# EAGLE board mixer (EAGLE 6.5.0), part 1 of 2
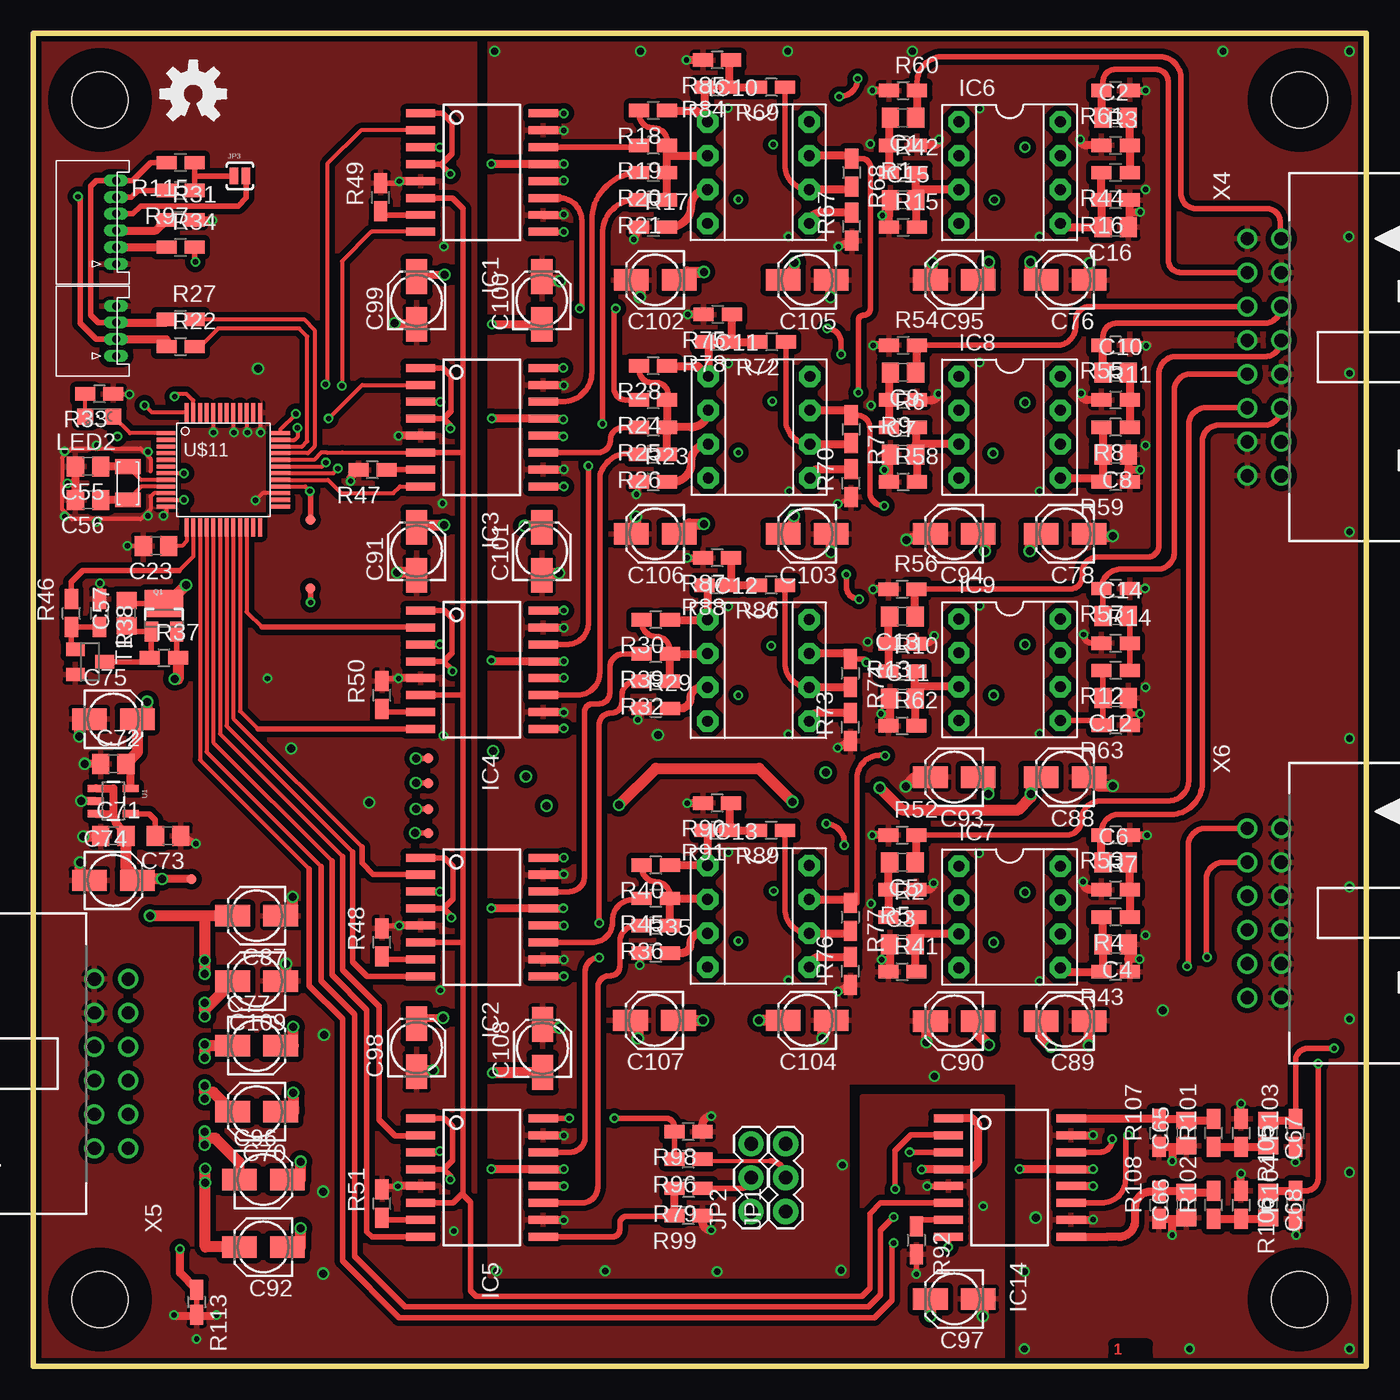
[diagram p2: board, top side]
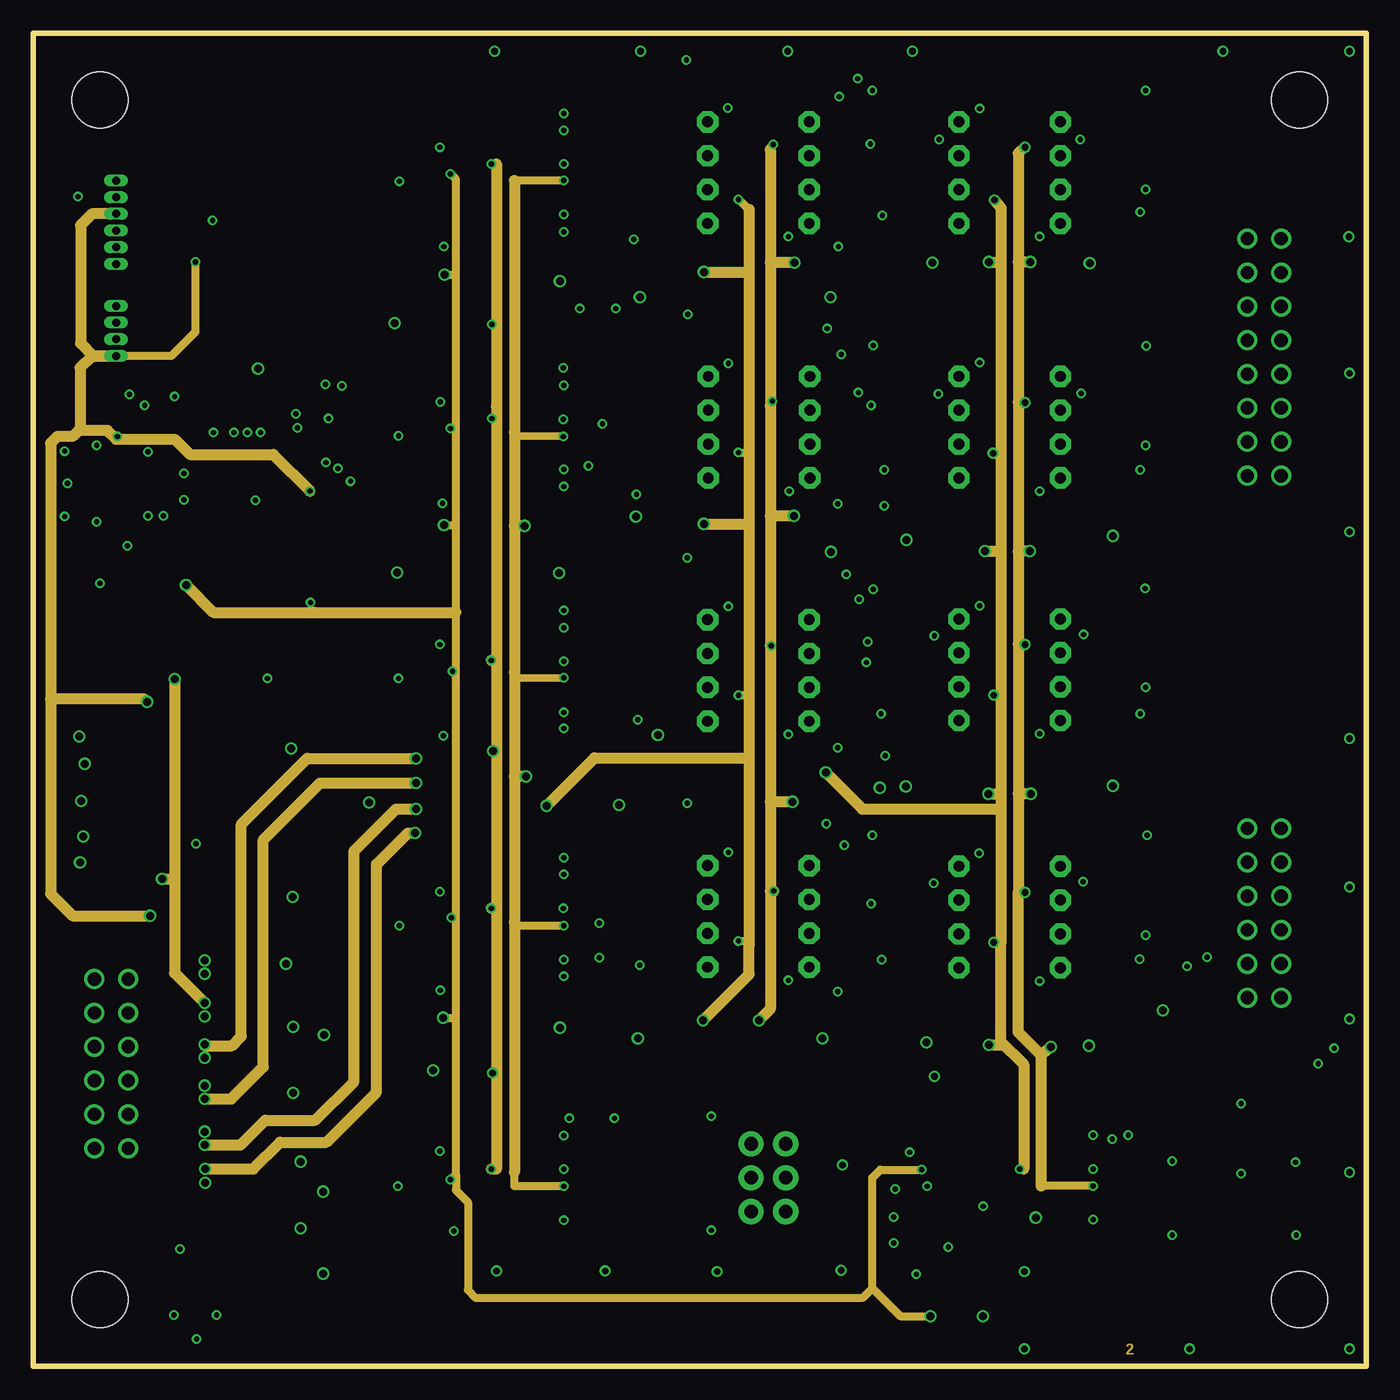
[diagram p3: board, inner layer Route2]
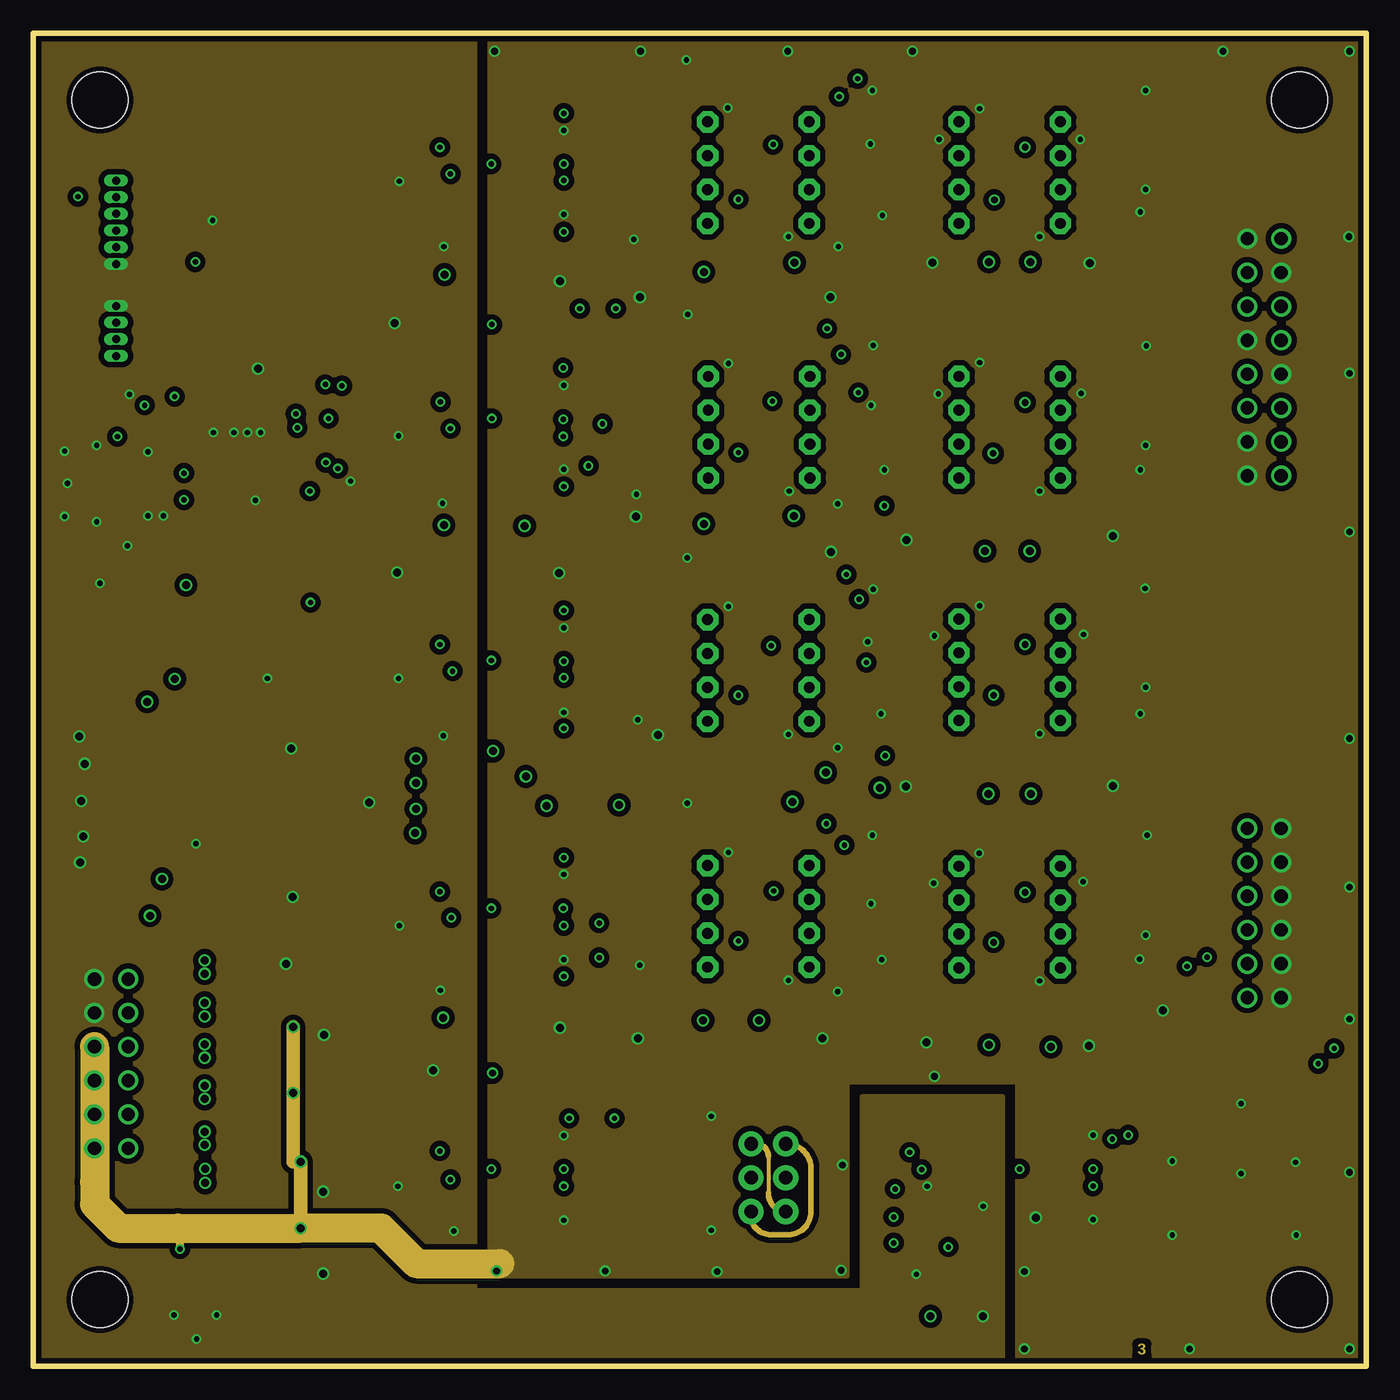
[diagram p4: board, inner layer Route15]
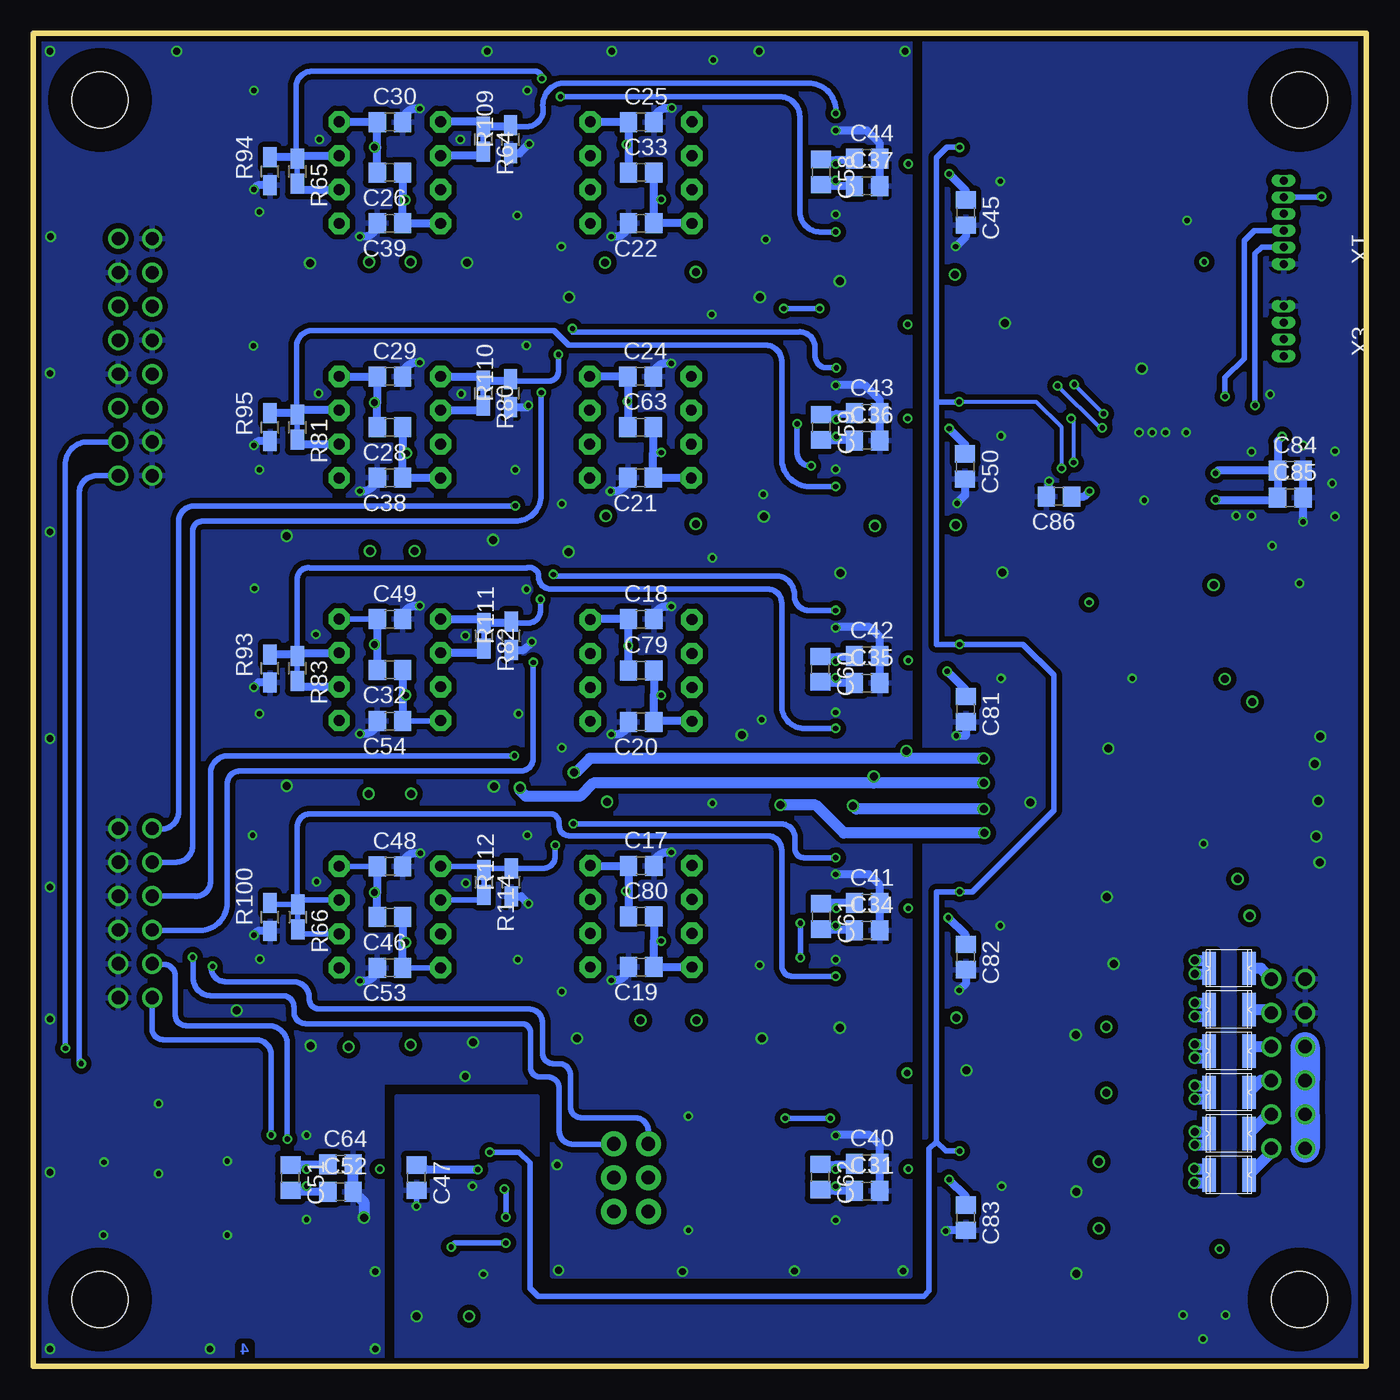
[diagram p5: board, bottom side, seen from below]

Size 100 x 100 mm. Coordinates in mm from the lower left corner, seen from the top.
Outline: 0,0 100,0 100,100 0,100 0,0
Copper layers (1*2*15*16): Top 0.035mm / dielectric 0.2mm / Route2 0.0175mm / dielectric 1.1mm / Route15 0.0175mm / dielectric 0.2mm / Bottom 0.035mm
Design rules "SeeedStudio_DRU_no_angle_20130527": minimum track width 6mil, minimum drill 12mil, track to track 6mil, track to pad 6mil, pad to pad 6mil, via to via 6mil, smd to smd 0mil, copper to edge 10mil, drill to drill 10mil, minimum pad ring 6mil, minimum via ring 6mil, stop-mask expansion 2mil, vias tented up to drill 25mil, thermal gap 10mil
Net classes: 1 vcc: width 0.203 mm
Holes 4.2 mm at 5,95 95,5 5,5 95,95
tRestrict: area 91.7,1.7 to 98.3,8.3; area 91.7,91.7 to 98.3,98.3; area 1.7,1.7 to 8.3,8.3; area 1.7,91.7 to 8.3,98.3
bRestrict: area 1.7,91.7 to 8.3,98.3; area 91.7,91.7 to 98.3,98.3; area 91.7,1.7 to 98.3,8.3; area 1.7,1.7 to 8.3,8.3

## Footprints (pad centres in the part's own frame; a part is rotated, then mirrored left to right if it is on the bottom)
C0805 = smd 1.3 x 1.5: 1 -0.95,0; 2 0.95,0
153CLV-0405 = smd 2.6 x 1.6: + 1.8,0; - -1.8,0
SO-16 = smd 0.6 x 2.2: 1 -4.445,-4.6; 2 -3.175,-4.6; 3 -1.905,-4.6; 4 -0.635,-4.6; 5 0.635,-4.6; 6 1.905,-4.6; 7 3.175,-4.6; 8 4.445,-4.6; 9 4.445,4.6; 10 3.175,4.6; 11 1.905,4.6; 12 0.635,4.6; 13 -0.635,4.6; 14 -1.905,4.6; 15 -3.175,4.6; 16 -4.445,4.6
DIL08 = drill 0.813 pad 1.6 octagon: 1 -3.81,-3.81; 2 -1.27,-3.81; 3 1.27,-3.81; 4 3.81,-3.81; 5 3.81,3.81; 6 1.27,3.81; 7 -1.27,3.81; 8 -3.81,3.81
1X03 = drill 1.016 pad 1.88: 1 0,0; 2 2.54,0; 3 5.08,0
SJ_2S-NO = smd 0.635 x 1.27: 1 -0.45,0; 2 0.45,0
CHIPLED_0805 = smd 1.2 x 1.2: A 0,-1.05; C 0,1.05
SOT23-3_POWER = smd 1 x 1.5: 1 -0.939,-1.384; 2 0.961,-1.384 | smd 2.9 x 2.05: 3 0.011,0.716
R0805W = smd 1.5 x 1: 1 -1.052,0; 2 1.052,0
R0805W' = smd 1.5 x 1: 1 -0.94,0; 2 0.94,0
SOT23 = smd 1 x 1.4: 1 -0.95,-1.1; 2 0.95,-1.1; 3 0,1.1
PAD.03X.03 = smd 0.762 x 0.762: P$1 0,0
SOT23-5 = smd 0.55 x 1.2: 1 -0.95,-1.3; 2 0,-1.3; 3 0.95,-1.3; 4 0.95,1.3; 5 -0.95,1.3
1210 = smd 1 x 2.5: P$1 -1.5,0; P$2 1.5,0
PT48 = smd 1.4 x 0.3: 1 -4.3,2.75; 2 -4.3,2.25; 3 -4.3,1.75; 4 -4.3,1.25; 5 -4.3,0.75; 6 -4.3,0.25; 7 -4.3,-0.25; 8 -4.3,-0.75; 9 -4.3,-1.25; 10 -4.3,-1.75; 11 -4.3,-2.25; 12 -4.3,-2.75; 25 4.3,-2.75; 26 4.3,-2.25; 27 4.3,-1.75; 28 4.3,-1.25; 29 4.3,-0.75; 30 4.3,-0.25; 31 4.3,0.25; 32 4.3,0.75; 33 4.3,1.25; 34 4.3,1.75; 35 4.3,2.25; 36 4.3,2.75 | smd 0.3 x 1.4: 13 -2.75,-4.3; 14 -2.25,-4.3; 15 -1.75,-4.3; 16 -1.25,-4.3; 17 -0.75,-4.3; 18 -0.25,-4.3; 19 0.25,-4.3; 20 0.75,-4.3; 21 1.25,-4.3; 22 1.75,-4.3; 23 2.25,-4.3; 24 2.75,-4.3; 37 2.75,4.3; 38 2.25,4.3; 39 1.75,4.3; 40 1.25,4.3; 41 0.75,4.3; 42 0.25,4.3; 43 -0.25,4.3; 44 -0.75,4.3; 45 -1.25,4.3; 46 -1.75,4.3; 47 -2.25,4.3; 48 -2.75,4.3
0530480610 = drill 0.6 pad 0.9 long: 1 0,0; 2 1.25,0; 3 2.5,0; 4 3.75,0; 5 5,0; 6 6.25,0
0530480401 = drill 0.6 pad 0.9 long: 1 0,0; 2 1.25,0; 3 2.5,0; 4 3.75,0
PAK100/2500-5-16 = drill 1 pad 1.422: 1 -8.89,-1.27; 2 -8.89,1.27; 3 -6.35,-1.27; 4 -6.35,1.27; 5 -3.81,-1.27; 6 -3.81,1.27; 7 -1.27,-1.27; 8 -1.27,1.27; 9 1.27,-1.27; 10 1.27,1.27; 11 3.81,-1.27; 12 3.81,1.27; 13 6.35,-1.27; 14 6.35,1.27; 15 8.89,-1.27; 16 8.89,1.27
PAK100/2500-5-12 = drill 1 pad 1.422: 1 -6.35,-1.27; 2 -6.35,1.27; 3 -3.81,-1.27; 4 -3.81,1.27; 5 -1.27,-1.27; 6 -1.27,1.27; 7 1.27,-1.27; 8 1.27,1.27; 9 3.81,-1.27; 10 3.81,1.27; 11 6.35,-1.27; 12 6.35,1.27
CRYSTAL-SMD-3.2X1.5 = smd 1.1 x 1.9: P$1 -1.25,0; P$2 1.25,0

## Placement (x,y rotation side)
C1  1u  [C0805]  65.25,93.65 180 top
C2  1u  [C0805]  81.2,93.65 0 top
C3  1n  [C0805]  65.2,31.65 0 top
C4  1n  [C0805]  81.2,31.65 180 top
C5  1u  [C0805]  65.2,37.8 180 top
C6  1u  [C0805]  81.2,37.8 0 top
C7  1n  [C0805]  65.25,68.4 0 top
C8  1n  [C0805]  81.2,68.4 180 top
C9  1u  [C0805]  65.25,74.55 180 top
C10  1u  [C0805]  81.2,74.55 0 top
C11  1n  [C0805]  65.2,50.1 0 top
C12  1n  [C0805]  81.2,50.15 180 top
C13  1u  [C0805]  65.2,56.25 180 top
C14  1u  [C0805]  81.2,56.3 0 top
C15  1n  [C0805]  65.25,87.5 0 top
C16  1n  [C0805]  81.2,85.45 180 top
C17  100n  [C0805]  54.4,37.55 0 bottom
C18  100n  [C0805]  54.4,56.05 0 bottom
C19  100n  [C0805]  54.4,29.95 180 bottom
C20  100n  [C0805]  54.4,48.35 180 bottom
C21  100n  [C0805]  54.45,66.65 180 bottom
C22  100n  [C0805]  54.4,85.75 180 bottom
C23  470nF  [C0805]  9.2,61.55 180 top
C24  100n  [C0805]  54.45,74.25 0 bottom
C25  100n  [C0805]  54.4,93.35 0 bottom
C26  100n  [C0805]  73.25,89.55 180 bottom
C28  100n  [C0805]  73.25,70.45 180 bottom
C29  100n  [C0805]  73.25,74.25 0 bottom
C30  100n  [C0805]  73.25,93.35 0 bottom
C31  100n  [C0805]  37.45,13.15 0 bottom
C32  100n  [C0805]  73.25,52.25 180 bottom
C33  100n  [C0805]  54.4,89.55 0 bottom
C34  100n  [C0805]  37.45,32.7 0 bottom
C35  100n  [C0805]  37.45,51.25 0 bottom
C36  100n  [C0805]  37.45,69.45 0 bottom
C37  100n  [C0805]  37.45,88.55 0 bottom
C38  100n  [C0805]  73.25,66.65 180 bottom
C39  100n  [C0805]  73.25,85.75 180 bottom
C40  100n  [C0805]  37.45,15.2 0 bottom
C41  100n  [C0805]  37.45,34.75 0 bottom
C42  100n  [C0805]  37.45,53.3 0 bottom
C43  100n  [C0805]  37.45,71.5 0 bottom
C44  100n  [C0805]  37.45,90.6 0 bottom
C45  100n  [C0805]  30.05,86.55 270 bottom
C46  100n  [C0805]  73.25,33.7 180 bottom
C47  100n  [C0805]  71.25,14.15 270 bottom
C48  100n  [C0805]  73.25,37.5 0 bottom
C49  100n  [C0805]  73.25,56.05 0 bottom
C50  100n  [C0805]  30.1,67.5 270 bottom
C51  100n  [C0805]  80.7,14.15 270 bottom
C52  100n  [C0805]  76.95,13.1 0 bottom
C53  100n  [C0805]  73.25,29.9 180 bottom
C54  100n  [C0805]  73.25,48.4 180 bottom
C55  22pF  [C0805]  4.1,67.5 180 top
C56  22pF  [C0805]  4.1,65 180 top
C57  100nF  [C0805]  7,56.5 90 top
C58  100n  [C0805]  40.9,89.6 270 bottom
C59  100n  [C0805]  40.9,70.45 270 bottom
C60  100n  [C0805]  40.95,52.3 270 bottom
C61  100n  [C0805]  40.9,33.75 270 bottom
C62  100n  [C0805]  40.95,14.2 270 bottom
C63  100n  [C0805]  54.45,70.45 0 bottom
C64  100n  [C0805]  76.95,15.15 0 bottom
C65  1n  [C0805]  86.5,17.5 90 top
C66  1n  [C0805]  86.5,12.1 90 top
C67  1u  [C0805]  92.65,17.5 270 top
C68  1u  [C0805]  92.65,12.1 270 top
C70  10u  [153CLV-0405]  16.75,19.1 180 top
C71  100nF  [C0805]  6,39.8 0 top
C72  100nF  [C0805]  6,45.2 0 top
C73  100nF  [C0805]  10.1,39.8 180 top
C74  10uF  [153CLV-0405]  6,36.45 0 top
C75  10uF  [153CLV-0405]  6,48.55 0 top
C76  10u  [153CLV-0405]  77.4,81.5 180 top
C77  10u  [153CLV-0405]  16.75,24.05 0 top
C78  10u  [153CLV-0405]  77.4,62.45 180 top
C79  100n  [C0805]  54.4,52.2 0 bottom
C80  100n  [C0805]  54.4,33.75 0 bottom
C81  100n  [C0805]  30.05,49.3 270 bottom
C82  100n  [C0805]  30.05,30.7 270 bottom
C83  100n  [C0805]  30.05,11.15 270 bottom
C84  100n  [C0805]  5.7,67.2 0 bottom
C85  100n  [C0805]  5.7,65.15 0 bottom
C86  100n  [C0805]  23.05,65.25 180 bottom
C87  10u  [153CLV-0405]  16.75,33.8 180 top
C88  10u  [153CLV-0405]  77.4,44.2 180 top
C89  10u  [153CLV-0405]  77.4,25.9 180 top
C90  10u  [153CLV-0405]  69.1,25.9 180 top
C91  10u  [153CLV-0405]  28.75,61.15 90 top
C92  10u  [153CLV-0405]  17.25,8.95 180 top
C93  10u  [153CLV-0405]  69.1,44.2 180 top
C94  10u  [153CLV-0405]  69.1,62.45 180 top
C95  10u  [153CLV-0405]  69.1,81.5 180 top
C96  10u  [153CLV-0405]  17.25,14 0 top
C97  10u  [153CLV-0405]  69.1,5.05 180 top
C98  10u  [153CLV-0405]  28.75,23.9 90 top
C99  10u  [153CLV-0405]  28.75,79.95 90 top
C100  10u  [153CLV-0405]  38.15,79.95 90 top
C101  10u  [153CLV-0405]  38.15,61.15 90 top
C102  10u  [153CLV-0405]  46.65,81.5 180 top
C103  10u  [153CLV-0405]  58.05,62.45 180 top
C104  10u  [153CLV-0405]  58.05,25.95 180 top
C105  10u  [153CLV-0405]  58.05,81.5 180 top
C106  10u  [153CLV-0405]  46.65,62.45 180 top
C107  10u  [153CLV-0405]  46.6,25.95 180 top
C108  10u  [153CLV-0405]  38.2,23.85 90 top
C109  10u  [153CLV-0405]  16.75,28.9 180 top
IC1  PGA2311  [SO-16]  33.65,89.55 270 top
IC2  PGA2311  [SO-16]  33.65,33.7 270 top
IC3  PGA2311  [SO-16]  33.65,70.45 270 top
IC4  PGA2311  [SO-16]  33.65,52.25 270 top
IC5  PGA2311  [SO-16]  33.65,14.15 270 top
IC6  OPA2134P  [DIL08]  73.25,89.55 270 top
IC7  OPA2134P  [DIL08]  73.25,33.7 270 top
IC8  OPA2134P  [DIL08]  73.25,70.45 270 top
IC9  OPA2134P  [DIL08]  73.25,52.25 270 top
IC10  OPA2134P  [DIL08]  54.4,89.55 270 top
IC11  OPA2134P  [DIL08]  54.45,70.45 270 top
IC12  OPA2134P  [DIL08]  54.4,52.2 270 top
IC13  OPA2134P  [DIL08]  54.4,33.75 270 top
IC14  PGA2311  [SO-16]  73.25,14.15 270 top
JP1  J1  [1X03]  56.45,11.6 90 top
JP2  J2  [1X03]  53.85,11.6 90 top
JP3  [SJ_2S-NO]  15.5,89.3 0 top
LED2  green  [CHIPLED_0805]  4.95,71.25 90 top
Q1  SI2305  [SOT23-3_POWER]  9.8,56.5 0 top
R1  DNP  [R0805W]  65.25,91.6 180 top
R2  1K  [R0805W]  65.2,33.7 0 top
R3  DNP  [R0805W]  81.2,91.6 0 top
R4  1K  [R0805W]  81.2,33.7 180 top
R5  DNP  [R0805W]  65.2,35.75 180 top
R6  1K  [R0805W]  65.25,70.45 0 top
R7  DNP  [R0805W]  81.2,35.75 0 top
R8  1K  [R0805W]  81.2,70.45 180 top
R9  DNP  [R0805W]  65.25,72.5 180 top
R10  1K  [R0805W]  65.2,52.15 0 top
R11  DNP  [R0805W]  81.2,72.5 0 top
R12  1K  [R0805W]  81.2,52.2 180 top
R13  DNP  [R0805W]  65.2,54.2 180 top
R14  DNP  [R0805W]  81.2,54.25 0 top
R15  100K  [R0805W]  65.25,85.45 0 top
R16  100K  [R0805W]  81.2,87.5 180 top
R17  4K7  [R0805W]  46.5,85.45 0 top
R18  10K  [R0805W]  46.5,94.2 180 top
R19  10K  [R0805W]  46.5,91.6 180 top
R20  10K  [R0805W]  46.5,89.55 180 top
R21  10K  [R0805W]  46.5,87.5 180 top
R22  2.2K  [R0805W]  11.05,76.5 0 top
R23  4K7  [R0805W]  46.5,66.35 0 top
R24  10K  [R0805W]  46.5,72.5 180 top
R25  10K  [R0805W]  46.5,70.45 180 top
R26  10K  [R0805W]  46.5,68.4 180 top
R27  2.2K  [R0805W]  11.05,78.55 0 top
R28  10K  [R0805W]  46.5,75.05 180 top
R29  4K7  [R0805W]  46.7,49.35 0 top
R30  10K  [R0805W]  46.7,56 180 top
R31  47k  [R0805W]  11.05,86 0 top
R32  10K  [R0805W]  46.7,51.4 180 top
R33  47k  [R0805W]  4.95,72.95 180 top
R34  47k  [R0805W]  11.05,83.95 0 top
R35  4K7  [R0805W]  46.7,31 0 top
R36  10K  [R0805W]  46.7,33.05 180 top
R37  10K  [R0805W]  9.8,53.15 0 top
R38  10K  [R0805W]  4.95,56.5 270 top
R39  10K  [R0805W]  46.7,53.45 180 top
R40  10K  [R0805W]  46.7,37.6 180 top
R41  100K  [R0805W]  65.2,29.6 0 top
R42  1K  [R0805W]  65.25,89.55 0 top
R43  100K  [R0805W]  81.2,29.6 180 top
R44  1K  [R0805W]  81.2,89.55 180 top
R45  10K  [R0805W]  46.7,35.1 180 top
R46  10K  [R0805W]  2.85,56.5 90 top
R47  47K  [R0805W]  25.45,67.25 180 top
R48  47K  [R0805W]  26.15,31.8 90 top
R49  47K  [R0805W]  26.05,87.7 90 top
R50  47K  [R0805W]  26.15,50.35 90 top
R51  47K  [R0805W]  26.15,12.2 90 top
R52  100K  [R0805W]  65.2,39.85 0 top
R53  100K  [R0805W]  81.2,39.85 180 top
R54  100K  [R0805W]  65.25,76.6 0 top
R55  100K  [R0805W]  81.2,76.6 180 top
R56  100K  [R0805W]  65.2,58.3 0 top
R57  100K  [R0805W]  81.2,58.35 180 top
R58  100K  [R0805W]  65.25,66.35 0 top
R59  100K  [R0805W]  81.2,66.35 180 top
R60  100K  [R0805W]  65.25,95.7 0 top
R61  100K  [R0805W]  81.2,95.7 180 top
R62  100K  [R0805W]  65.2,48.05 0 top
R63  100K  [R0805W]  81.2,48.1 180 top
R64  0R_0805  [R0805W']  66.25,92.05 270 bottom
R65  0R_0805  [R0805W']  80.2,89.65 270 bottom
R66  0R_0805  [R0805W']  80.15,33.7 270 bottom
R67  4K7  [R0805W]  61.4,85.5 90 top
R68  10K  [R0805W]  61.4,89.55 270 top
R69  10K  [R0805W]  55.35,95.95 180 top
R70  4K7  [R0805W]  61.35,66.25 90 top
R71  10K  [R0805W]  61.35,70.3 270 top
R72  10K  [R0805W]  55.4,76.85 180 top
R73  4K7  [R0805W]  61.3,47.95 90 top
R74  10K  [R0805W]  61.3,52 270 top
R75  DNP  [R0805W]  51.35,78.9 180 top
R76  4K7  [R0805W]  61.3,29.65 90 top
R77  10K  [R0805W]  61.3,33.7 270 top
R78  0R_0805  [R0805W']  51.35,76.85 180 top
R79  10K  [R0805W]  49.17,13.34 180 top
R80  0R_0805  [R0805W']  66.25,73 270 bottom
R81  0R_0805  [R0805W']  80.2,70.45 270 bottom
R82  0R_0805  [R0805W']  66.2,54.8 270 bottom
R83  0R_0805  [R0805W']  80.2,52.35 270 bottom
R84  0R_0805  [R0805W']  51.3,95.95 180 top
R85  DNP  [R0805W]  51.3,98 180 top
R86  10K  [R0805W]  55.35,58.6 180 top
R87  DNP  [R0805W]  51.3,60.65 180 top
R88  0R_0805  [R0805W']  51.3,58.6 180 top
R89  10K  [R0805W]  55.35,40.2 180 top
R90  DNP  [R0805W]  51.3,42.25 180 top
R91  0R_0805  [R0805W']  51.3,40.2 180 top
R92  47K  [R0805W]  66.25,9.45 270 top
R93  DNP  [R0805W]  82.25,52.35 90 bottom
R94  DNP  [R0805W]  82.25,89.65 90 bottom
R95  DNP  [R0805W]  82.25,70.45 90 bottom
R96  10K  [R0805W]  49.15,15.54 180 top
R97  NA/4K7  [R0805W]  11.05,88.2 180 top
R98  4K7  [R0805W]  49.15,17.6 180 top
R99  4K7  [R0805W]  49.15,11.3 180 top
R100  DNP  [R0805W]  82.25,33.7 90 bottom
R101  1K  [R0805W]  88.55,17.5 90 top
R102  1K  [R0805W]  88.55,12.1 90 top
R103  100K  [R0805W]  94.7,17.5 90 top
R104  100K  [R0805W]  94.7,12.1 90 top
R105  DNP  [R0805W]  90.6,17.5 270 top
R106  DNP  [R0805W]  90.6,12.1 270 top
R107  100K  [R0805W]  84.45,17.5 90 top
R108  100K  [R0805W]  84.45,12.1 90 top
R109  DNP  [R0805W]  64.2,92.05 90 bottom
R110  DNP  [R0805W]  64.2,73 90 bottom
R111  DNP  [R0805W]  64.15,54.8 90 bottom
R112  DNP  [R0805W]  64.15,36.3 90 bottom
R113  0R_0805  [R0805W']  12.25,4.8 270 top
R114  0R_0805  [R0805W']  66.2,36.3 270 bottom
R115  NA/4K7  [R0805W]  11.05,90.3 180 top
T1  BC846  [SOT23]  4.25,52.85 270 top
TP1  TEST-POINT3  [PAD.03X.03]  29.65,40 0 top
TP2  TEST-POINT3  [PAD.03X.03]  29.65,41.8 0 top
TP3  TEST-POINT3  [PAD.03X.03]  29.65,43.75 0 top
TP4  TEST-POINT3  [PAD.03X.03]  29.65,45.6 0 top
TP5  TEST-POINT3  [PAD.03X.03]  11.85,36.55 0 top
TP6  TEST-POINT3  [PAD.03X.03]  20.8,63.5 0 top
TP7  TEST-POINT3  [PAD.03X.03]  20.8,58.35 0 top
U1  V_REG_LDOSMD  [SOT23-5]  6,42.4 270 top
U$2  RESETTABLE  [1210]  10.3,14.35 180 bottom
U$5  RESETTABLE  [1210]  10.3,17.45 180 bottom
U$6  RESETTABLE  [1210]  10.3,20.55 180 bottom
U$7  OSHW-LOGOM  [OSHW-LOGO-M]  12,95.45 0 top
U$9  RESETTABLE  [1210]  10.3,23.65 180 bottom
U$11  F55[0/1]X---PT48  [PT48]  14.25,67.25 0 top
U$12  RESETTABLE  [1210]  10.3,26.75 180 bottom
U$13  RESETTABLE  [1210]  10.3,29.85 180 bottom
X1  MOLEX_6HORIZONTAL  [0530480610]  6.2,82.7 90 top
X3  display  [0530480401]  6.2,75.8 90 top
X4  input  [PAK100/2500-5-16]  92.35,75.7 270 top
X5  2512-5  [PAK100/2500-5-12]  5.85,22.7 90 top
X6  2512-5  [PAK100/2500-5-12]  92.35,34 270 top
Y1  32768Hz CFPX-217 12.5pF  [CRYSTAL-SMD-3.2X1.5]  7.1,66.25 90 top